# Altium schematic sheet 02-Mezzanine.SchDoc: ECE453 Power
size A; Date: 4/25/2017; ApprovedBy: JSK; CheckedBy: JSK; Author: JSK; CompanyName: University of Wisconsin; DrawnBy: JSK; Engineer: JSK; Organization: ECE 315; Address1: College of Engineering; Address2: 1415 Engineering Drive; Address3: Madison, WI 53706; Address4: ECE 453 Fall 2022; Revision: A; SheetNumber: 2; SheetTotal: 2; AssemblyNumber: ECE453-F22-01
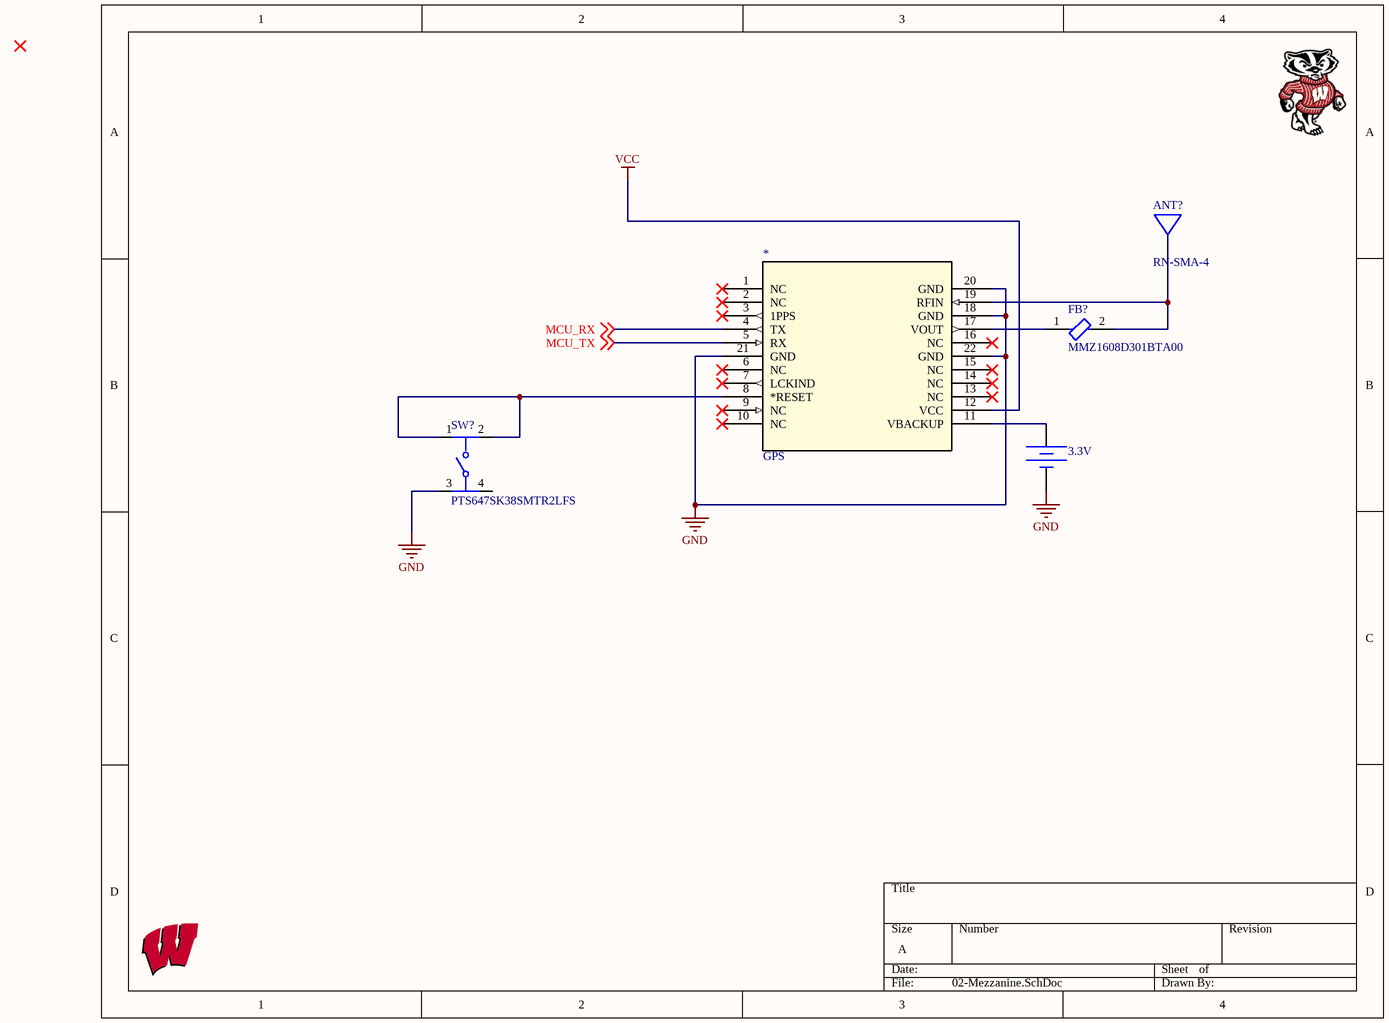
[diagram p0: 02-Mezzanine.SchDoc]

## Parts
3.3V  Constant Voltage Source  (value not drawn)
*  GPS
ANT?  RN-SMA-4  [FP-RN-SMA-4-MFG]
FB?  MMZ1608D301BTA00  [FP-MMZ1608-0_8-MFG]
SW?  PTS647SK38SMTR2LFS  [FP-PTS647SK38SMTR2LFS-MFG]

## Nets
GND: 3.3V.2 *.18(GND) *.20(GND) *.21(GND) *.22(GND) SW?.3
VCC: *.12(VCC)
MCU_RX: *.4(TX) ; off-sheet MCU_RX
MCU_TX: *.5(RX) ; off-sheet MCU_TX
Net3.3V_1: 3.3V.1 *.11(VBACKUP)
Net*_8: *.8(*RESET) SW?.1 SW?.2
Net*_17: *.17(VOUT) FB?.1
Net*_19: *.19(RFIN) FB?.2

Not connected (* = marked no-connect by the designer): * 1(NC)* 2(NC)* 3(1PPS)* 6(NC)* 7(LCKIND)* 9(NC)* 10(NC)* 13(NC)* 14(NC)* 15(NC)* 16(NC)*; SW? 4

## Library data of the parts
3.3V = Battery: SimulationGenericComponent: True; DC Magnitude: 5
ANT? = CMP-06329-000002-1: RF ANT 2.4GHZ WHIP SMA MALE 4"; Number of Bands: 1; Input Impedance: 50R; VSWR: 1.9; Bandwidth: 120MHz; Frequency: 2.45GHz; REACH SVHC: No SVHC; Height: 4.449inch; Packaging: Bulk; Case/Package: SMA; Package Quantity: 1; Lead Free: Lead Free; Series: -; Termination: SMA; Connector Type: SMA; Radiation Hardening: No; Impedance: 50R; Mount: Connector
FB? = CMP-08257-000452-1: Signal Line Ferrite Bead 300Ω  @ 100MHz 300mA DCR 700mΩ SMD 0603; DC Resistance (DCR): 700mR; Impedance: 300R; Case/Package: 0603; Max DC Current: 300mA; REACH SVHC: No SVHC; Case Code (Imperial): 0603; Case Code (Metric): 1608; Length: 0.063inch; Mount: Surface Mount; RoHS Compliant: Yes; Current Rating: 300mA; Packaging: Cut Tape; Width: 0.031inch; Height: 0.037inch; Package Quantity: 4000; Series: MMZ
SW? = CMP-10040-000033-1: TACT 4.5 X 4.5, 3.8 MM H, 2.5N,; Switch Function: Off-Mom; Switch Travel: 0.25mm; Actuator Type: Standard; Illumination Type: Non-Illuminated; Mechanical Life: 100000Cycles; Ratings: IP40; Operating Force: 250gf; Throw Configuration: SPST; Max Operating Temperature: 70°C; Min Operating Temperature: -20°C; Termination: Gull Wing; Mount: Surface Mount; Packaging: Tape and Reel